# Altium schematic sheet Main_scheme.SchDoc
size A4; SheetNumber: 1; SheetTotal: 7
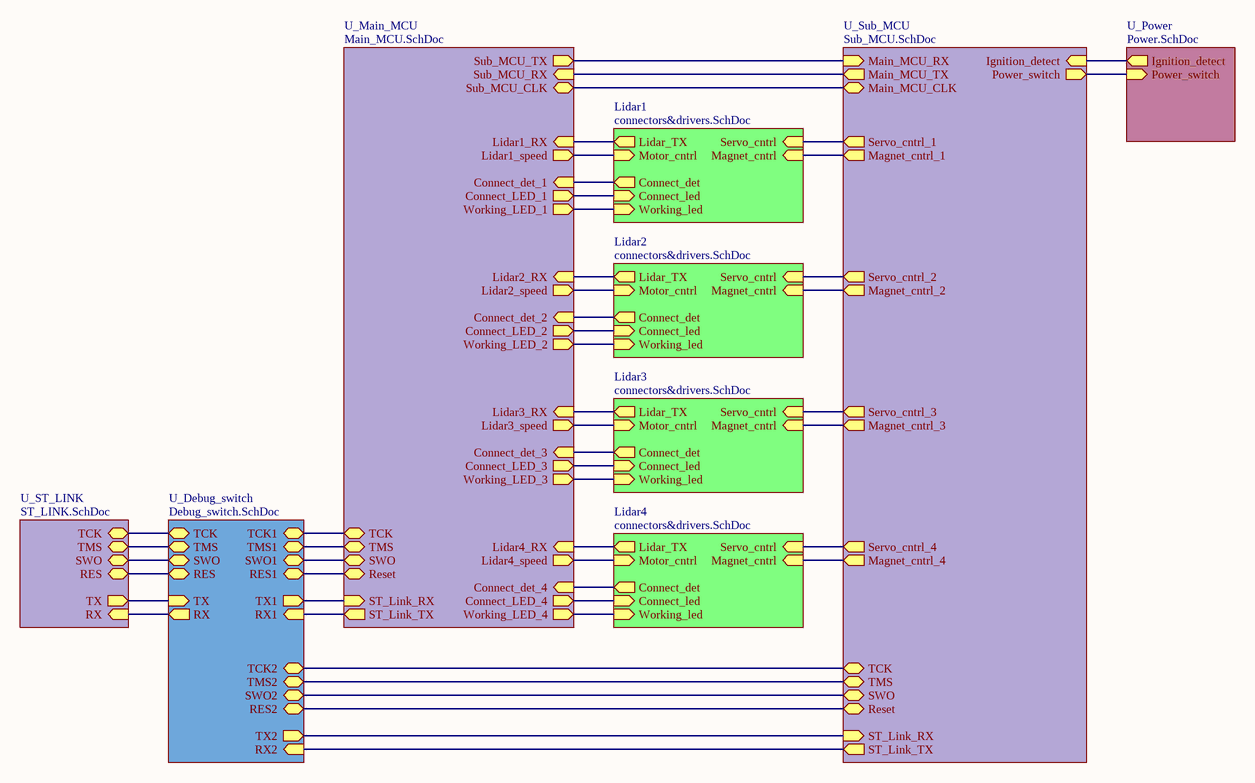
[diagram p0: Main_scheme.SchDoc]

## Sub-sheets
Lidar1 = connectors&drivers.SchDoc: Servo_cntrl (in), Motor_cntrl (in), Magnet_cntrl (in), Lidar_TX (out), Connect_det (out), Connect_led (in), Working_led (in)
Lidar2 = connectors&drivers.SchDoc: Servo_cntrl (in), Motor_cntrl (in), Magnet_cntrl (in), Lidar_TX (out), Connect_det (out), Connect_led (in), Working_led (in)
Lidar3 = connectors&drivers.SchDoc: Servo_cntrl (in), Motor_cntrl (in), Magnet_cntrl (in), Lidar_TX (out), Connect_det (out), Connect_led (in), Working_led (in)
Lidar4 = connectors&drivers.SchDoc: Servo_cntrl (in), Motor_cntrl (in), Magnet_cntrl (in), Lidar_TX (out), Connect_det (out), Connect_led (in), Working_led (in)
U_Debug_switch = Debug_switch.SchDoc: SWO (bidir), RES (bidir), TMS (bidir), TCK (bidir), SWO1 (bidir), RES1 (bidir), SWO2 (bidir), RES2 (bidir), TMS1 (bidir), TCK1 (bidir), TMS2 (bidir), TCK2 (bidir), TX1 (out), RX1 (in), TX2 (out), RX2 (in), TX (in), RX (out)
U_Main_MCU = Main_MCU.SchDoc: TMS (bidir), TCK (bidir), SWO (bidir), Reset (bidir), Lidar1_RX (in), ST_Link_RX (in), ST_Link_TX (out), Lidar2_RX (in), Lidar3_RX (in), Lidar4_RX (in), Sub_MCU_RX (in), Sub_MCU_TX (out), Lidar1_speed (out), Lidar2_speed (out), Lidar4_speed (out), Lidar3_speed (out), Connect_det_1 (in), Connect_LED_1 (out), Working_LED_1 (out), Connect_det_2 (in), Connect_LED_2 (out), Working_LED_2 (out), Connect_det_3 (in), Connect_LED_3 (out), Working_LED_3 (out), Connect_det_4 (in), Connect_LED_4 (out), Working_LED_4 (out), Sub_MCU_CLK (bidir)
U_Power = Power.SchDoc: Ignition_detect (out), Power_switch (in)
U_ST_LINK = ST_LINK.SchDoc: SWO (bidir), RES (bidir), TMS (bidir), TCK (bidir), TX (out), RX (in)
U_Sub_MCU = Sub_MCU.SchDoc: TMS (bidir), TCK (bidir), SWO (bidir), Reset (bidir), Servo_cntrl_1 (out), Servo_cntrl_2 (out), Servo_cntrl_3 (out), Servo_cntrl_4 (out), Magnet_cntrl_1 (out), Magnet_cntrl_2 (out), Magnet_cntrl_3 (out), Magnet_cntrl_4 (out), ST_Link_RX (in), ST_Link_TX (out), Main_MCU_RX (in), Main_MCU_TX (out), Main_MCU_CLK (bidir), Ignition_detect (in), Power_switch (out)

## Nets
(unnamed): sheet Lidar1/Servo_cntrl, sheet U_Sub_MCU/Servo_cntrl_1
(unnamed): sheet Lidar1/Motor_cntrl, sheet U_Main_MCU/Lidar1_speed
(unnamed): sheet Lidar1/Magnet_cntrl, sheet U_Sub_MCU/Magnet_cntrl_1
(unnamed): sheet Lidar1/Lidar_TX, sheet U_Main_MCU/Lidar1_RX
(unnamed): sheet Lidar1/Connect_det, sheet U_Main_MCU/Connect_det_1
(unnamed): sheet Lidar1/Connect_led, sheet U_Main_MCU/Connect_LED_1
(unnamed): sheet Lidar1/Working_led, sheet U_Main_MCU/Working_LED_1
(unnamed): sheet Lidar2/Servo_cntrl, sheet U_Sub_MCU/Servo_cntrl_2
(unnamed): sheet Lidar2/Motor_cntrl, sheet U_Main_MCU/Lidar2_speed
(unnamed): sheet Lidar2/Magnet_cntrl, sheet U_Sub_MCU/Magnet_cntrl_2
(unnamed): sheet Lidar2/Lidar_TX, sheet U_Main_MCU/Lidar2_RX
(unnamed): sheet Lidar2/Connect_det, sheet U_Main_MCU/Connect_det_2
(unnamed): sheet Lidar2/Connect_led, sheet U_Main_MCU/Connect_LED_2
(unnamed): sheet Lidar2/Working_led, sheet U_Main_MCU/Working_LED_2
(unnamed): sheet Lidar3/Servo_cntrl, sheet U_Sub_MCU/Servo_cntrl_3
(unnamed): sheet Lidar3/Motor_cntrl, sheet U_Main_MCU/Lidar3_speed
(unnamed): sheet Lidar3/Magnet_cntrl, sheet U_Sub_MCU/Magnet_cntrl_3
(unnamed): sheet Lidar3/Lidar_TX, sheet U_Main_MCU/Lidar3_RX
(unnamed): sheet Lidar3/Connect_det, sheet U_Main_MCU/Connect_det_3
(unnamed): sheet Lidar3/Connect_led, sheet U_Main_MCU/Connect_LED_3
(unnamed): sheet Lidar3/Working_led, sheet U_Main_MCU/Working_LED_3
(unnamed): sheet Lidar4/Servo_cntrl, sheet U_Sub_MCU/Servo_cntrl_4
(unnamed): sheet Lidar4/Motor_cntrl, sheet U_Main_MCU/Lidar4_speed
(unnamed): sheet Lidar4/Magnet_cntrl, sheet U_Sub_MCU/Magnet_cntrl_4
(unnamed): sheet Lidar4/Lidar_TX, sheet U_Main_MCU/Lidar4_RX
(unnamed): sheet Lidar4/Connect_det, sheet U_Main_MCU/Connect_det_4
(unnamed): sheet Lidar4/Connect_led, sheet U_Main_MCU/Connect_LED_4
(unnamed): sheet Lidar4/Working_led, sheet U_Main_MCU/Working_LED_4
(unnamed): sheet U_Main_MCU/TMS, sheet U_Debug_switch/TMS1
(unnamed): sheet U_Main_MCU/TCK, sheet U_Debug_switch/TCK1
(unnamed): sheet U_Main_MCU/SWO, sheet U_Debug_switch/SWO1
(unnamed): sheet U_Main_MCU/Reset, sheet U_Debug_switch/RES1
(unnamed): sheet U_Main_MCU/ST_Link_RX, sheet U_Debug_switch/TX1
(unnamed): sheet U_Main_MCU/ST_Link_TX, sheet U_Debug_switch/RX1
(unnamed): sheet U_Main_MCU/Sub_MCU_RX, sheet U_Sub_MCU/Main_MCU_TX
(unnamed): sheet U_Main_MCU/Sub_MCU_TX, sheet U_Sub_MCU/Main_MCU_RX
(unnamed): sheet U_Main_MCU/Sub_MCU_CLK, sheet U_Sub_MCU/Main_MCU_CLK
(unnamed): sheet U_Debug_switch/SWO, sheet U_ST_LINK/SWO
(unnamed): sheet U_Debug_switch/RES, sheet U_ST_LINK/RES
(unnamed): sheet U_Debug_switch/TMS, sheet U_ST_LINK/TMS
(unnamed): sheet U_Debug_switch/TCK, sheet U_ST_LINK/TCK
(unnamed): sheet U_Debug_switch/SWO2, sheet U_Sub_MCU/SWO
(unnamed): sheet U_Debug_switch/RES2, sheet U_Sub_MCU/Reset
(unnamed): sheet U_Debug_switch/TMS2, sheet U_Sub_MCU/TMS
(unnamed): sheet U_Debug_switch/TCK2, sheet U_Sub_MCU/TCK
(unnamed): sheet U_Debug_switch/TX2, sheet U_Sub_MCU/ST_Link_RX
(unnamed): sheet U_Debug_switch/RX2, sheet U_Sub_MCU/ST_Link_TX
(unnamed): sheet U_Debug_switch/TX, sheet U_ST_LINK/TX
(unnamed): sheet U_Debug_switch/RX, sheet U_ST_LINK/RX
(unnamed): sheet U_Sub_MCU/Ignition_detect, sheet U_Power/Ignition_detect
(unnamed): sheet U_Sub_MCU/Power_switch, sheet U_Power/Power_switch